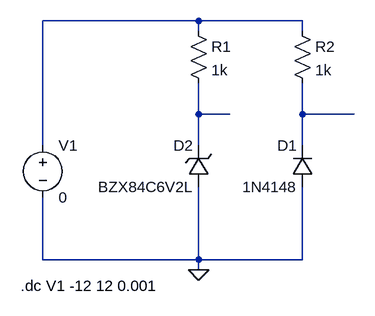
[diagram p0: schematic ex5_diodo.asc]
ex5_diodo.asc, the LTspice schematic file:
Version 4
SHEET 1 880 680
WIRE 160 -48 -80 -48
WIRE 320 -48 160 -48
WIRE 160 -32 160 -48
WIRE 320 -32 320 -48
WIRE 160 96 160 48
WIRE 208 96 160 96
WIRE 320 96 320 48
WIRE 400 96 320 96
WIRE -80 144 -80 -48
WIRE 160 144 160 96
WIRE 320 144 320 96
WIRE -80 320 -80 224
WIRE 160 320 160 208
WIRE 160 320 -80 320
WIRE 320 320 320 208
WIRE 320 320 160 320
WIRE 160 336 160 320
FLAG 160 336 0
SYMBOL diode 336 208 R180
WINDOW 0 24 64 Left 2
WINDOW 3 24 0 Left 2
SYMATTR InstName D1
SYMATTR Value 1N4148
SYMBOL zener 176 208 R180
WINDOW 0 24 64 Left 2
WINDOW 3 24 0 Left 2
SYMATTR InstName D2
SYMATTR Value BZX84C6V2L
SYMATTR Description Diode
SYMATTR Type diode
SYMBOL voltage -80 128 R0
SYMATTR InstName V1
SYMATTR Value 0
SYMBOL res 144 -48 R0
SYMATTR InstName R1
SYMATTR Value 1k
SYMBOL res 304 -48 R0
SYMATTR InstName R2
SYMATTR Value 1k
TEXT -114 360 Left 2 !.dc V1 -12 12 0.001

The netlist it stands for:
* ex5_diodo.asc
D1 0 N003 1N4148
D2 0 N002 BZX84C6V2L
V1 N001 0 0
R1 N001 N002 1k
R2 N001 N003 1k
.model D D
.lib standard.dio
.dc V1 -12 12 0.001
.backanno
.end